# Altium schematic sheet Display_LED.SchDoc
size 63 x 63 mm
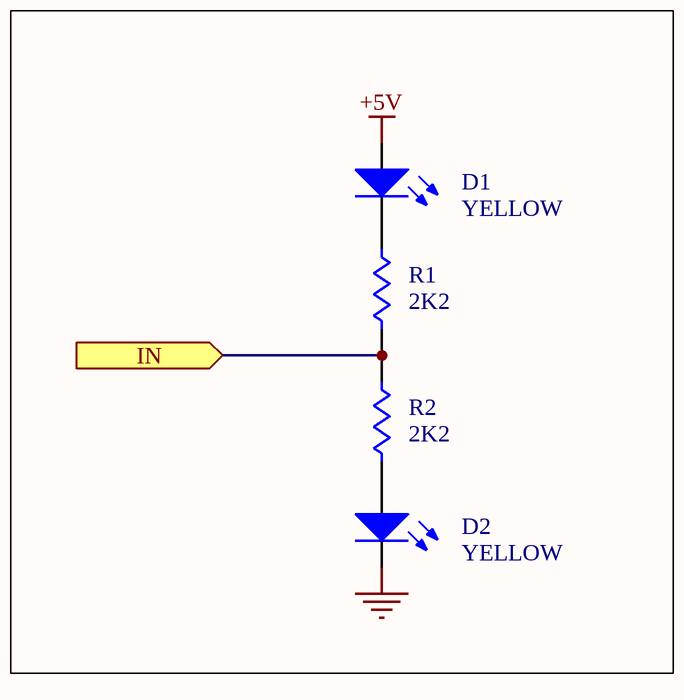
[diagram p0: Display_LED.SchDoc]

## Parts
D1  YELLOW  [0805_Diode]
D2  YELLOW  [0805_Diode]
R1  2K2  [0805]
R2  2K2  [0805]

## Ports
IN (in)

## Nets
+5V: D1.1(A)
GND: D2.2(K)
IN: R1.1 R2.2 ; port IN
NetD1_2: D1.2(K) R1.2
NetD2_1: D2.1(A) R2.1

## Library data of the parts
D1 D2 = Optical Transmitter: Typical INFRARED GaAs LED; Manufacturer: Generic Components; Class I: Optoelectronic; Published: 8-Jun-2000; Revision: July-2002: Re-released for DXP Platform.; Publisher: Altium Limited; Class II: LED
R1 R2 = Res1: Resistor; Manufacturer: Generic Components; Class I: Passive; Published: 8-Jun-2000; Revision: July-2002: Re-released for DXP Platform.; Publisher: Altium Limited; Class II: Resistor